# Altium schematic sheet WS2812bDiode.SchDoc
size A4; SheetNumber: 8; SheetTotal: 8
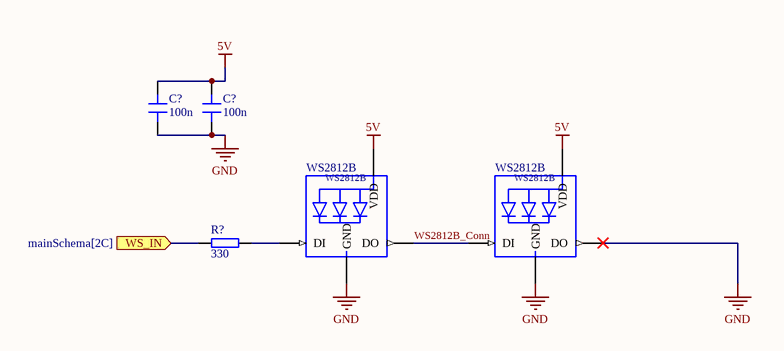
[diagram p0: WS2812bDiode.SchDoc]

## Parts
(Parts that share a designator on the sheet are numbered #1, #2 ... from top to bottom, then left to right.)
C?#1  100n
C?#2  100n
LED  WS2812B  [WS2812B]
LED?  WS2812B  [WS2812B]
R?  330

## Ports
WS_IN (in, see mainSchema[2C])

## Nets
5V: C?#1.2 C?#2.2 LED.1-VDD(VDD) LED?.1-VDD(VDD)
GND: C?#1.1 C?#2.1 LED.3-GND(GND) LED?.2-DOUT(DO) LED?.3-GND(GND)
WS2812B_Conn: LED.2-DOUT(DO) LED?.4-DIN(DI)
WS_IN: R?.1 ; port WS_IN
NetLED_4-DIN: LED.4-DIN(DI) R?.2

## Library data of the parts
C?#1 C?#2 = Capacitor: Value: *; HelpURL: *; MPN: *; Supplier: *; SupplierPartNumber: *
LED LED? = WS2812B: Raspberry Pi HAT _40 pin_ Wheeled Robotics Kit; MF: SparkFun Electronics; Availability: Unavailable; SnapEDA_Link: https://www.snapeda.com/parts/WS2812B/Worldsemi/view-part/1038297/?ref=snap; MP: WS2812B; Price: None; Value: *; Package: None
R? = Resistor: Value: *; HelpURL: *; MPN: *; Supplier: *; SupplierPartNumber: *